# EAGLE schematic lsar (EAGLE 9.5.0)
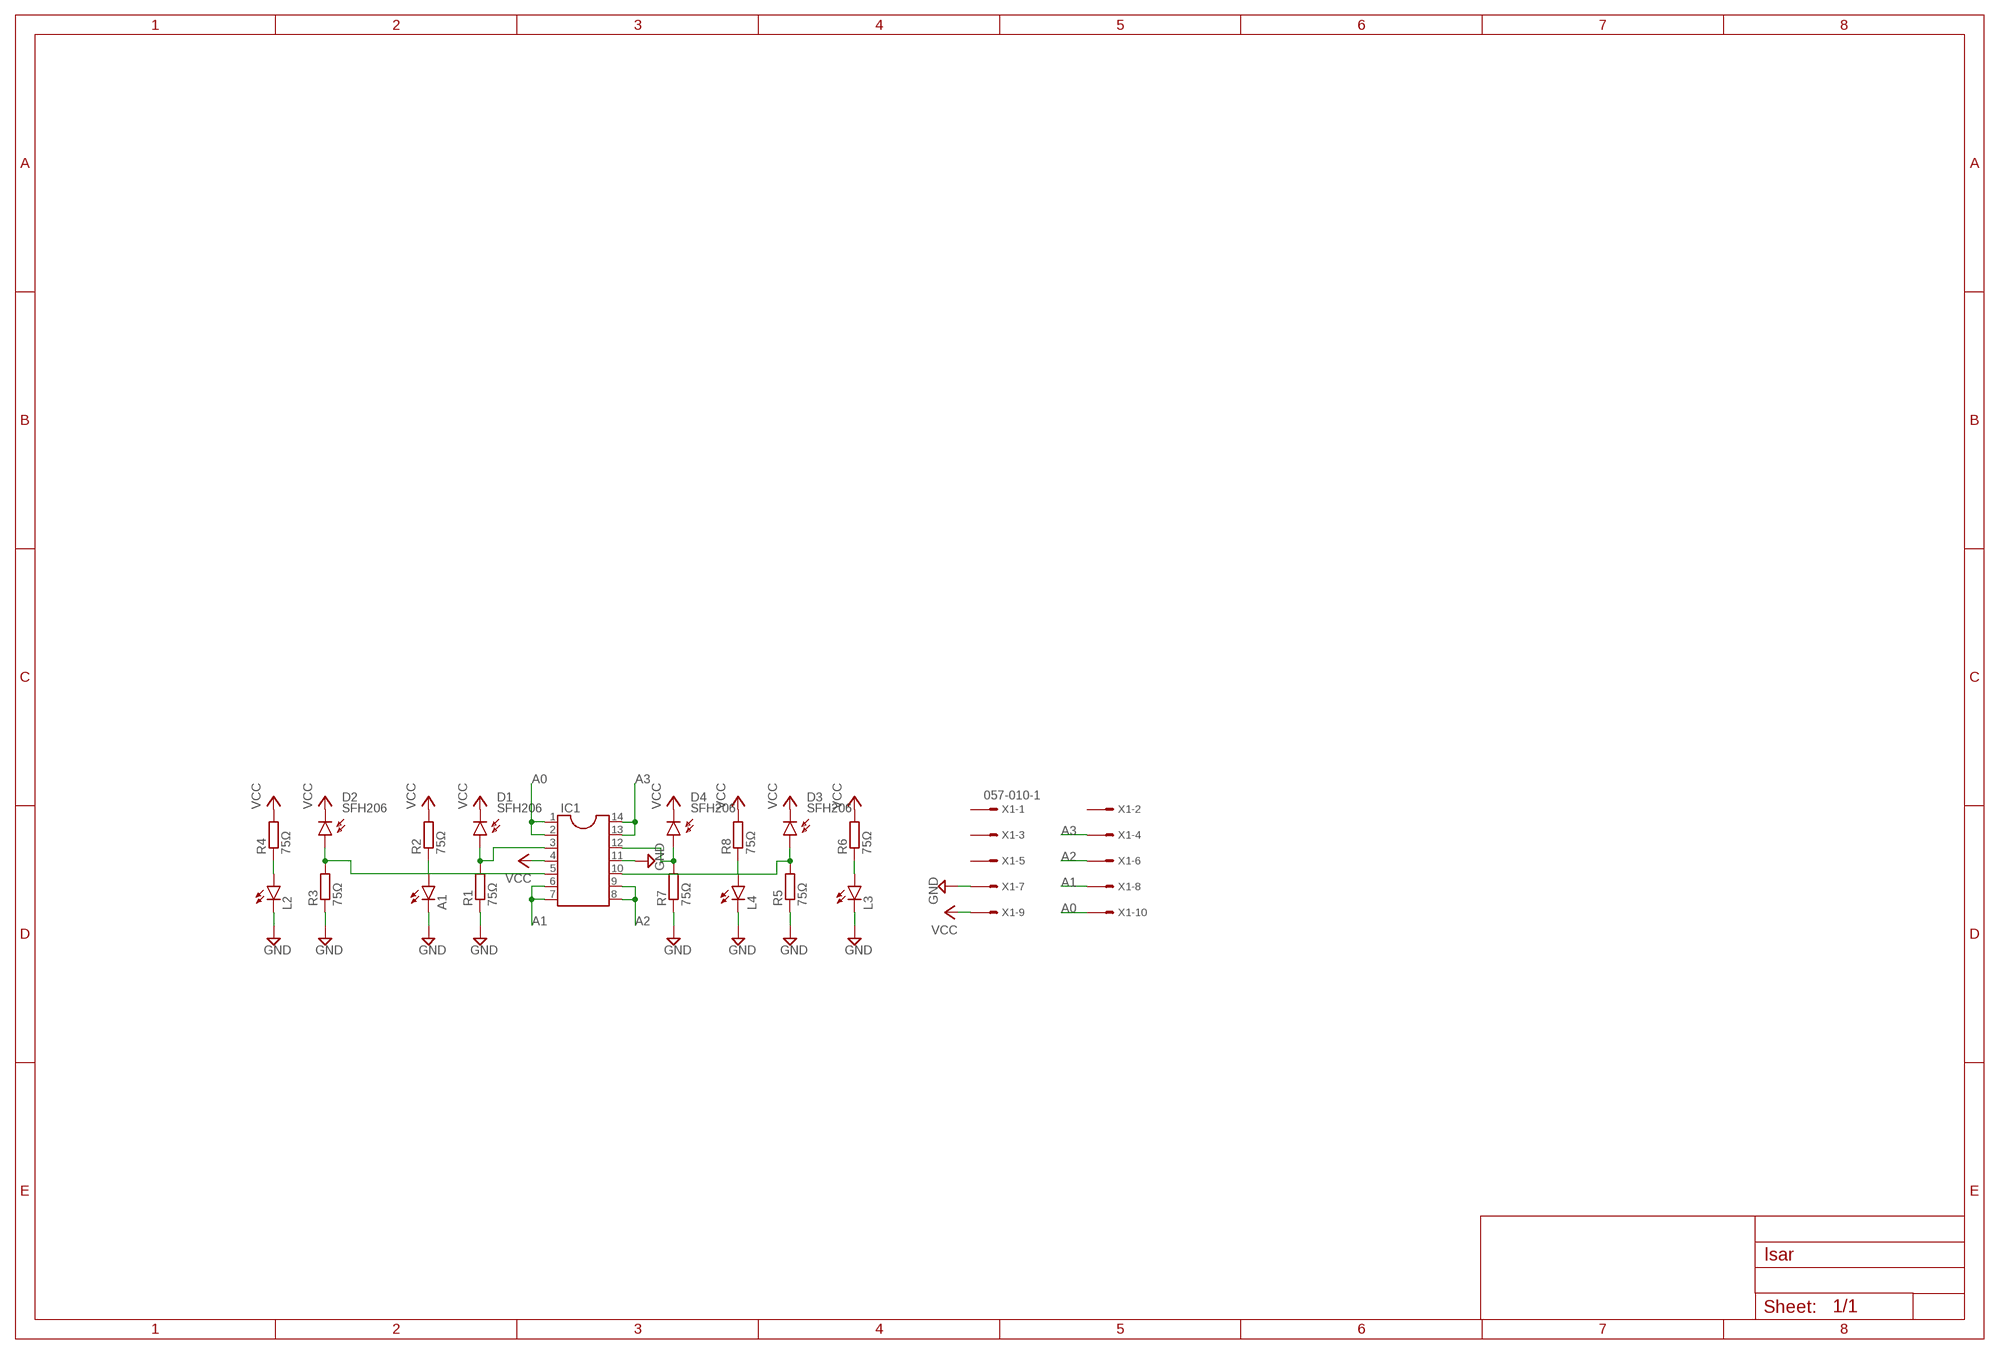
[diagram p0: schematic, sheet 1]

## Parts
A1  LED3MM  [LED3MM]
D1  SFH206  [SFH206]
D2  SFH206  [SFH206]
D3  SFH206  [SFH206]
D4  SFH206  [SFH206]
IC1  DIL14S  [SOCKET-14]
L2  LED3MM  [LED3MM]
L3  LED3MM  [LED3MM]
L4  LED3MM  [LED3MM]
R1  75Ω  R-EU_0207/10  [0207/10]
R2  75Ω  R-EU_0207/10  [0207/10]
R3  75Ω  R-EU_0207/10  [0207/10]
R4  75Ω  R-EU_0207/10  [0207/10]
R5  75Ω  R-EU_0207/10  [0207/10]
R6  75Ω  R-EU_0207/10  [0207/10]
R7  75Ω  R-EU_0207/10  [0207/10]
R8  75Ω  R-EU_0207/10  [0207/10]
X1  057-010-1  [057-010-1]

## Nets
A0: IC1.1 IC1.2 X1.10
A1: IC1.6 IC1.7 X1.8
A2: IC1.8 IC1.9 X1.6
A3: IC1.13 IC1.14 X1.4
GND: A1.K(C) IC1.11 L2.K(C) L3.K(C) L4.K(C) R1.1 R3.1 R5.1 R7.1 X1.7
N$1: A1.A R2.1
N$2: D1.A IC1.3 R1.2
N$3: L2.A R4.1
N$4: D2.A IC1.5 R3.2
N$5: L4.A R8.1
N$6: D4.A IC1.12 R7.2
N$8: L3.A R6.1
NS7: D3.A IC1.10 R5.2
VCC: D1.K(C) D2.K(C) D3.K(C) D4.K(C) IC1.4 R2.2 R4.2 R6.2 R8.2 X1.9
Unconnected: X1.1 X1.2 X1.3 X1.5

## Library data of the parts
A1 L2-L4 = led:LED: LED OSRAM: - CHIPLED LG R971, LG N971, LY N971, LG Q971, LY Q971, LO R971, LY R971 LH N974, LH R974 LS Q976, LO Q976, LY Q976 LO Q996 - Hyper CHIPLED LW Q18S LB Q993, LB Q99A, LB R99A - SideLED LS A670, LO A670, LY A670, LG A670, LP A670 LB A673, LV A673, LT A673, LW A673 LH A674 LY A675 LS A676, LA A676, LO A676, LY A676, LW A676 LS A679, LY A679, LG A679 - Hyper Micro SIDELED® LS Y876, LA Y876, LO Y876, LY Y876 LT Y87S - SmartLED LW L88C, LW L88S LB L89C, LB L89S, LG L890 LS L89K, LO L89K, LY L89K LS L896, LA L896, LO L896, LY L896 - TOPLED LS T670, LO T670, LY T670, LG T670, LP T670 LSG T670, LSP T670, LSY T670, LOP T670, LYG T670 LG T671, LOG T671, LSG T671 LB T673, LV T673, LT T673, LW T673 LH T674 LS T676, LA T676, LO T676, LY T676, LB T676, LH T676, LSB T676, LW T676 LB T67C, LV T67C, LT T67C, LS T67K, LO T67K, LY T67K, LW E67C LS E67B, LA E67B, LO E67B, LY E67B, LB E67C, LV E67C, LT E67C LW T67C LS T679, LY T679, LG T679 LS T770, LO T770, LY T770, LG T770, LP T770 LB T773, LV T773, LT T773, LW T773 LH T774 LS E675, LA E675, LY E675, LS T675 LS T776, LA T776, LO T776, LY T776, LB T776 LHGB T686 LT T68C, LB T68C - Hyper Mini TOPLED® LB M676 - Mini TOPLED Santana® LG M470 LS M47K, LO M47K, LY M47K Source: http://www.osram.convergy.de LUXEON: - LUMILED® LXK2-PW12-R00, LXK2-PW12-S00, LXK2-PW14-U00, LXK2-PW14-V00 LXK2-PM12-R00, LXK2-PM12-S00, LXK2-PM14-U00 LXK2-PE12-Q00, LXK2-PE12-R00, LXK2-PE12-S00, LXK2-PE14-T00, LXK2-PE14-U00 LXK2-PB12-K00, LXK2-PB12-L00, LXK2-PB12-M00, LXK2-PB14-N00, LXK2-PB14-P00, LXK2-PB14-Q00 LXK2-PR12-L00, LXK2-PR12-M00, LXK2-PR14-Q00, LXK2-PR14-R00 LXK2-PD12-Q00, LXK2-PD12-R00, LXK2-PD12-S00 LXK2-PH12-R00, LXK2-PH12-S00 LXK2-PL12-P00, LXK2-PL12-Q00, LXK2-PL12-R00 Source: www.luxeon.com KINGBRIGHT: KA-3528ASYC Source: www.kingbright.com
D1-D4 = opto-trans-siemens:SFH206: PHOTO DIODE; MPN: SFH206K; OC_FARNELL: 1212741; OC_NEWARK: 01M8807
IC1 = ic-package:DIL14: Dual In Line / Socket
R1-R8 = resistor:R-EU_: RESISTOR, European symbol
X1 = con-panduit:057-010-: CONNECTOR 10-pin series 057 contact pc board low profile headers; OC_FARNELL: unknown; OC_NEWARK: unknown